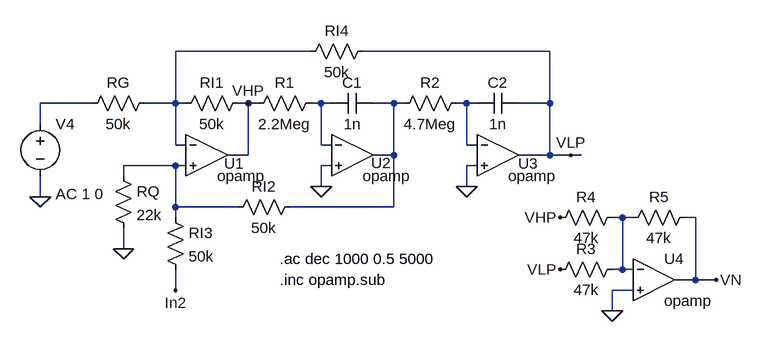
[diagram p0: schematic TPL1.asc]
TPL1.asc, the LTspice schematic file:
Version 4
SHEET 1 1380 680
WIRE 80 -1040 -128 -1040
WIRE 448 -1040 160 -1040
WIRE -256 -960 -336 -960
WIRE -128 -960 -128 -1040
WIRE -128 -960 -176 -960
WIRE -112 -960 -128 -960
WIRE -16 -960 -32 -960
WIRE 0 -960 -16 -960
WIRE 96 -960 80 -960
WIRE 112 -960 96 -960
WIRE 208 -960 176 -960
WIRE 224 -960 208 -960
WIRE 320 -960 304 -960
WIRE 336 -960 320 -960
WIRE 448 -960 448 -1040
WIRE 448 -960 400 -960
WIRE -336 -928 -336 -960
WIRE -128 -896 -128 -960
WIRE -112 -896 -128 -896
WIRE 96 -896 96 -960
WIRE 112 -896 96 -896
WIRE 320 -896 320 -960
WIRE 336 -896 320 -896
WIRE -16 -880 -16 -960
WIRE -16 -880 -48 -880
WIRE 208 -880 208 -960
WIRE 208 -880 176 -880
WIRE 448 -880 448 -960
WIRE 448 -880 400 -880
WIRE 480 -880 448 -880
WIRE 496 -880 480 -880
WIRE -128 -864 -208 -864
WIRE -112 -864 -128 -864
WIRE 112 -864 96 -864
WIRE 336 -864 320 -864
WIRE -208 -848 -208 -864
WIRE 96 -832 96 -864
WIRE 320 -832 320 -864
WIRE -336 -816 -336 -848
WIRE -128 -800 -128 -864
WIRE -32 -800 -128 -800
WIRE 208 -800 208 -880
WIRE 208 -800 48 -800
WIRE -128 -784 -128 -800
WIRE 560 -784 544 -784
WIRE 576 -784 560 -784
WIRE 672 -784 656 -784
WIRE -208 -736 -208 -768
WIRE 560 -704 560 -784
WIRE 560 -704 544 -704
WIRE 576 -704 560 -704
WIRE 672 -688 672 -784
WIRE 672 -688 640 -688
WIRE 704 -688 672 -688
WIRE -128 -672 -128 -704
WIRE 576 -672 544 -672
WIRE 544 -640 544 -672
FLAG 320 -832 0
FLAG 96 -832 0
FLAG -336 -816 0
FLAG -128 -672 In2
FLAG -208 -736 0
FLAG 544 -640 0
FLAG 480 -880 VLP
FLAG 464 -704 VLP
FLAG -16 -960 VHP
FLAG 464 -784 VHP
FLAG 704 -688 VN
SYMBOL voltage -336 -944 R0
WINDOW 123 24 124 Left 2
WINDOW 39 0 0 Left 0
SYMATTR Value2 AC 1 0
SYMATTR InstName V4
SYMATTR Value ""
SYMBOL Opamps\\opamp -80 -944 R0
WINDOW 0 27 77 Left 2
SYMATTR InstName U1
SYMBOL Opamps\\opamp 144 -944 R0
WINDOW 0 29 76 Left 2
SYMATTR InstName U2
SYMBOL Opamps\\opamp 368 -944 R0
WINDOW 0 31 77 Left 2
SYMATTR InstName U3
SYMBOL cap 176 -976 R90
WINDOW 0 0 32 VBottom 2
WINDOW 3 32 32 VTop 2
SYMATTR InstName C1
SYMATTR Value 1n
SYMBOL cap 400 -976 R90
WINDOW 0 0 32 VBottom 2
WINDOW 3 32 32 VTop 2
SYMATTR InstName C2
SYMATTR Value 1n
SYMBOL res -160 -976 R90
WINDOW 0 0 56 VBottom 2
WINDOW 3 32 56 VTop 2
SYMATTR InstName RG
SYMATTR Value 50k
SYMBOL res 176 -1056 R90
WINDOW 0 0 56 VBottom 2
WINDOW 3 32 56 VTop 2
SYMATTR InstName RI4
SYMATTR Value 50k
SYMBOL res -16 -976 R90
WINDOW 0 0 56 VBottom 2
WINDOW 3 32 56 VTop 2
SYMATTR InstName RI1
SYMATTR Value 50k
SYMBOL res 96 -976 R90
WINDOW 0 0 56 VBottom 2
WINDOW 3 32 56 VTop 2
SYMATTR InstName R1
SYMATTR Value 2.2Meg
SYMBOL res 320 -976 R90
WINDOW 0 0 56 VBottom 2
WINDOW 3 32 56 VTop 2
SYMATTR InstName R2
SYMATTR Value 4.7Meg
SYMBOL res -48 -784 R270
WINDOW 0 32 56 VTop 2
WINDOW 3 0 56 VBottom 2
SYMATTR InstName RI2
SYMATTR Value 50k
SYMBOL res -144 -800 R0
SYMATTR InstName RI3
SYMATTR Value 50k
SYMBOL Opamps\\opamp 608 -752 R0
SYMATTR InstName U4
SYMBOL res -224 -864 R0
SYMATTR InstName RQ
SYMATTR Value 22k
SYMBOL res 560 -720 R90
WINDOW 0 0 56 VBottom 2
WINDOW 3 32 56 VTop 2
SYMATTR InstName R3
SYMATTR Value 47k
SYMBOL res 560 -800 R90
WINDOW 0 0 56 VBottom 2
WINDOW 3 32 56 VTop 2
SYMATTR InstName R4
SYMATTR Value 47k
SYMBOL res 672 -800 R90
WINDOW 0 0 56 VBottom 2
WINDOW 3 32 56 VTop 2
SYMATTR InstName R5
SYMATTR Value 47k
TEXT 32 -720 Left 2 !.ac dec 1000 0.5 5000
TEXT 32 -688 Left 2 !.inc opamp.sub

The netlist it stands for:
* TPL1.asc
V4 N002 0 AC 1 0
XU1 N001 N006 VHP opamp Aol=100K GBW=10Meg  ; pins invin noninvin out
XU2 N003 0 N004 opamp Aol=100K GBW=10Meg  ; pins invin noninvin out
XU3 N005 0 VLP opamp Aol=100K GBW=10Meg  ; pins invin noninvin out
C1 N004 N003 1n
C2 VLP N005 1n
RG N001 N002 50k
RI4 VLP N001 50k
RI1 VHP N001 50k
R1 N003 VHP 2.2Meg
R2 N005 N004 4.7Meg
RI2 N006 N004 50k
RI3 N006 In2 50k
XU4 N007 0 VN opamp Aol=100K GBW=10Meg  ; pins invin noninvin out
RQ N006 0 22k
R3 N007 VLP 47k
R4 N007 VHP 47k
R5 VN N007 47k
.ac dec 1000 0.5 5000
.inc opamp.sub
.backanno
.end